# EAGLE schematic delay_v03 (EAGLE 6.2)
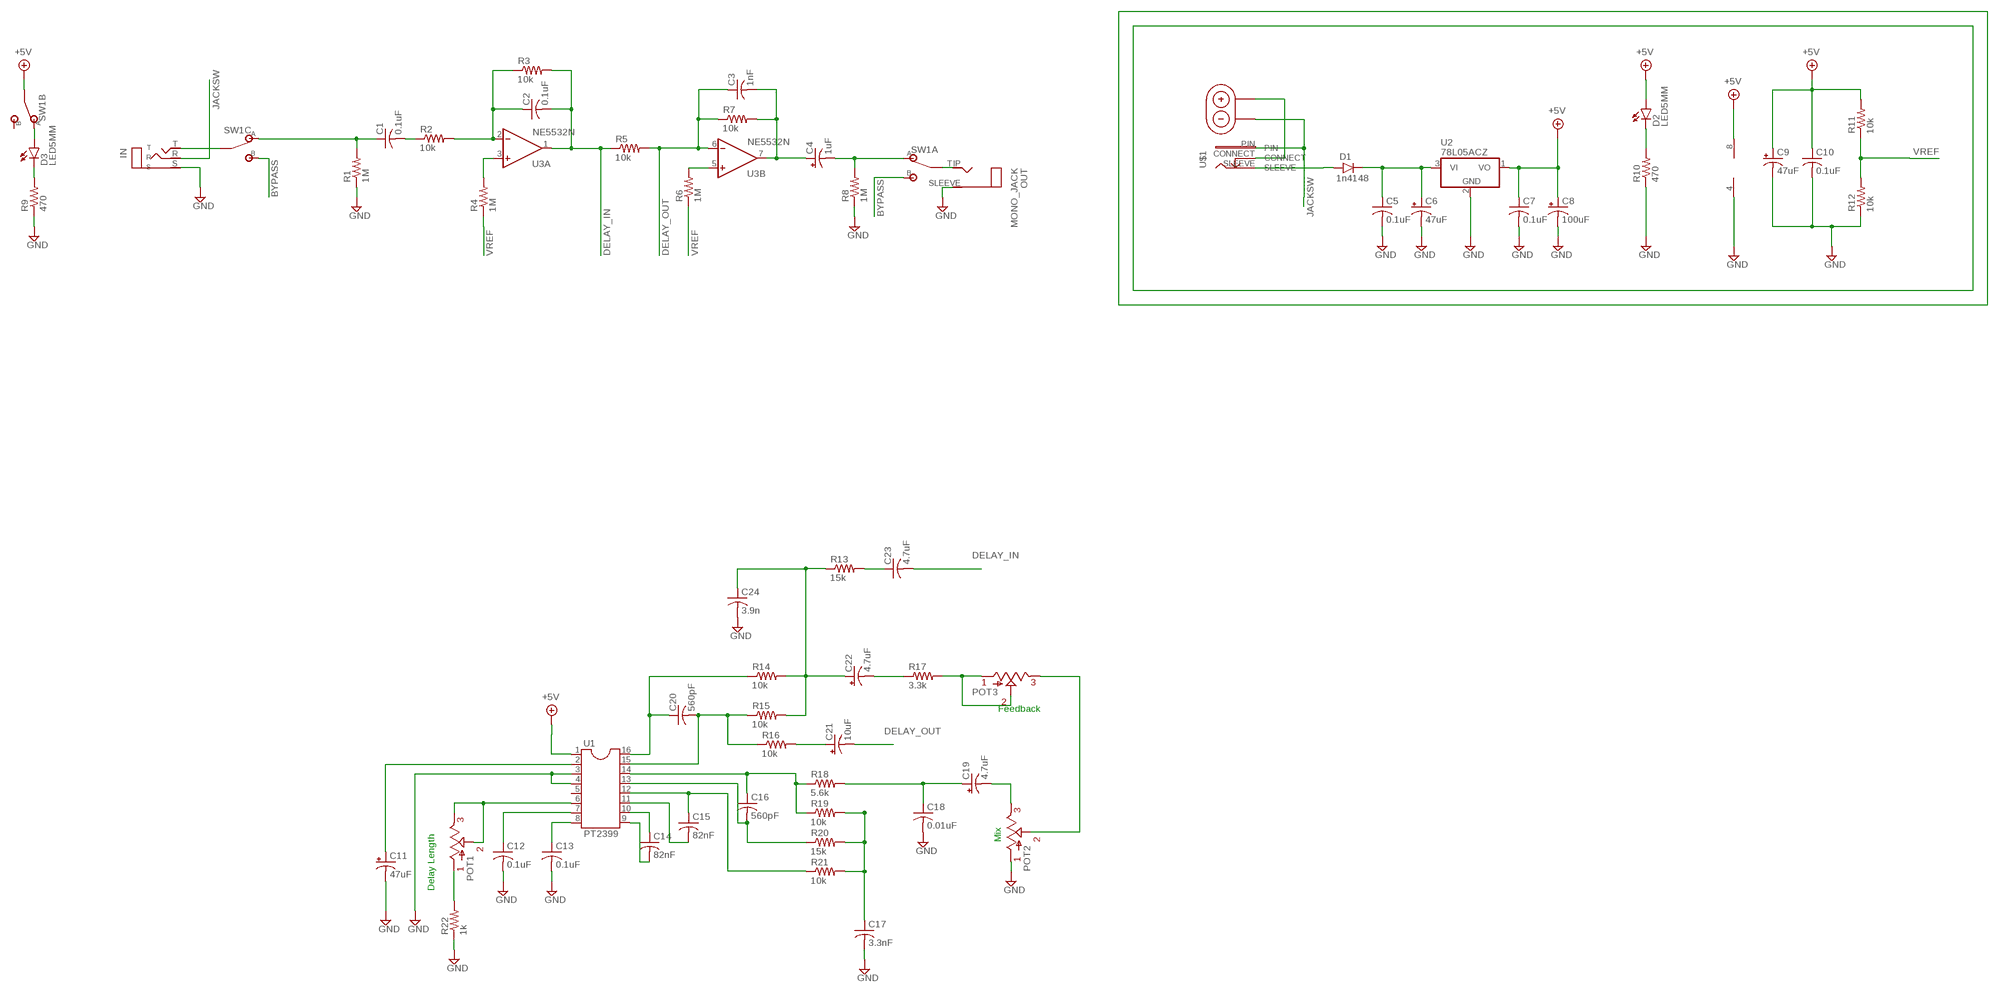
[diagram p0: schematic, sheet 1]

## Parts
C1  0.1uF  C-US050-035X075  [C050-035X075]
C2  0.1uF  C-US050-035X075  [C050-035X075]
C3  1nF  C-US050-035X075  [C050-035X075]
C4  1uF  0631  [063_025]
C5  0.1uF  C-US050-035X075  [C050-035X075]
C6  47uF  0631  [063_025]
C7  0.1uF  C-US050-035X075  [C050-035X075]
C8  100uF  0631  [063_025]
C9  47uF  0631  [063_025]
C10  0.1uF  C-US050-035X075  [C050-035X075]
C11  47uF  0631  [063_025]
C12  0.1uF  C-US050-035X075  [C050-035X075]
C13  0.1uF  C-US050-035X075  [C050-035X075]
C14  82nF  C-US050-035X075  [C050-035X075]
C15  82nF  C-US050-035X075  [C050-035X075]
C16  560pF  C-US050-035X075  [C050-035X075]
C17  3.3nF  C-US050-035X075  [C050-035X075]
C18  0.01uF  C-US050-035X075  [C050-035X075]
C19  4.7uF  0631  [063_025]
C20  560pF  C-US050-035X075  [C050-035X075]
C21  10uF  0631  [063_025]
C22  4.7uF  0631  [063_025]
C23  4.7uF  C-US050-035X075  [C050-035X075]
C24  3.9n  C-US050-035X075  [C050-035X075]
D1  1n4148  1N400X.3  [DO41-3]
D2  LED5MM  [LED5MM]
D3  LED5MM  [LED5MM]
IN  STEREO_JACK  [STEREO_JACK]
OUT  MONO_JACK  [MONO_JACK]
POT1  POT  [POT]
POT2  POT  [POT]
POT3  POT  [POT]
R1  1M  RESISTOR  [RESISTOR]
R2  10k  RESISTOR  [RESISTOR]
R3  10k  RESISTOR  [RESISTOR]
R4  1M  RESISTOR  [RESISTOR]
R5  10k  RESISTOR  [RESISTOR]
R6  1M  RESISTOR  [RESISTOR]
R7  10k  RESISTOR  [RESISTOR]
R8  1M  RESISTOR  [RESISTOR]
R9  470  RESISTOR  [RESISTOR]
R10  470  RESISTOR  [RESISTOR]
R11  10k  RESISTOR  [RESISTOR]
R12  10k  RESISTOR  [RESISTOR]
R13  15k  RESISTOR  [RESISTOR]
R14  10k  RESISTOR  [RESISTOR]
R15  10k  RESISTOR  [RESISTOR]
R16  10k  RESISTOR  [RESISTOR]
R17  3.3k  RESISTOR  [RESISTOR]
R18  5.6k  RESISTOR  [RESISTOR]
R19  10k  RESISTOR  [RESISTOR]
R20  15k  RESISTOR  [RESISTOR]
R21  10k  RESISTOR  [RESISTOR]
R22  1k  RESISTOR  [RESISTOR]
SW1  3PDT  [3PDT]
U1  PT2399  DIL16S  [SOCKET-16]
U2  78L05ACZ  [TO-92]
U3  NE5532N  [DIL08]
U$1  DC_JACK_OFFBOARD  [DC_JACK_OFFBOARD]
U$2  9V_BATTERY_CLIP  [9V_BATTERY]

## Nets
9V: C5.1 C6.+ D1.C U2.3(VI)
BYPASS: SW1.A3(A:B) SW1.C3(C:B)
C5*: C13.1 U1.8
DELAY_IN: C2.2 C23.2 R3.2 R5.1 U3.1(A:OUT)
DELAY_OUT: C3.1 C21.- R5.2 R7.1 U3.6(B:-IN)
DELAY_OUT_UNBUFFERED: R6.2 U3.5(B:+IN)
GND: C5.2 C6.- C7.2 C8.- C9.- C10.2 C11.- C12.2 C13.2 C17.2 C18.2 C24.2 IN.S OUT.SLEEVE POT2.1 R1.1 R8.1 R9.1 R10.1 R12.1 R22.1 U1.3 U1.4 U2.2(GND) U3.4(P:V-)
JACKSW: IN.R U$1.PIN U$2.9V_BATTERY_-
N$1: C23.1 R13.2
N$2: C12.1 U1.7
N$3: C14.2 U1.9
N$4: C14.1 U1.10
N$5: C17.1 R19.2 R20.2 R21.2
N$6: C15.1 R21.1 U1.12
N$7: POT1.2 POT1.3 U1.6
N$9: C11.+ U1.2
N$10: C1.1 R1.2 SW1.C1(C:A)
N$11: POT1.1 R22.2
N$12: C16.2 R20.1 U1.13
N$13: OUT.TIP SW1.A2(A:COM)
N$14: C20.2 R15.1 R16.1 U1.15
N$15: C20.1 R14.1 U1.16
N$16: C18.1 C19.+ R18.2
N$17: C15.2 U1.11
N$18: C2.1 R2.2 R3.1 U3.2(A:-IN)
N$19: C19.- POT2.3
N$20: C22.+ C24.1 R13.1 R14.2 R15.2
N$21: C22.- R17.1
N$22: C1.2 R2.1
N$24: POT2.2 POT3.3
N$25: C21.+ R16.2
N$26: C16.1 R18.1 R19.1 U1.14
N$27: D3.A SW1.B1(B:A)
N$28: C3.2 C4.+ R7.2 U3.7(B:OUT)
N$29: D2.K(C) R10.2
N$30: D1.A U$1.SLEEVE
N$31: IN.T SW1.C2(C:COM)
N$32: C4.- R8.2 SW1.A1(A:A)
N$33: U$1.CONNECT U$2.9V_BATTERY_+
N$34: D3.K(C) R9.2
N$35: POT3.1 POT3.2 R17.2
N$36: R4.2 U3.3(A:+IN)
VA: C7.1 C8.+ C9.+ C10.1 D2.A R11.2 SW1.B2(B:COM) U1.1 U2.1(VO) U3.8(P:V+) ; supply symbol labelled +5V
VREF: R4.1 R6.1 R11.1 R12.2
Unconnected: SW1.B3(B:B) U1.5

## Notes on the sheet
- Feedback
- Mix
- Delay Length

## Library data of the parts
C1-C3 C5 C7 C10 C12-C18 C20 C23 C24 = resistor:C-US: CAPACITOR, American symbol
C4 C6 C8 C9 C11 C19 C21 C22 = gm-caps-electro-pol:063: 33 - 220uF Xicon values at Mouser.com 10V: 220uF; 16V: 100uF; 25V: 100uF; 50V: 33uF
D1 = gm-diodes:1N400X: Rectifier Diodes often used in power supply to prevent damage from reverse polarization
D2 D3 = gm-diodes:LED
IN = 00_steve:STEREO_JACK
OUT = 00_steve:MONO_JACK
POT1-POT3 = 00_steve:POT
R1-R22 = 00_steve:RESISTOR
SW1 = 00_steve:3PDT
U1 = ic-package:DIL16: Dual In Line / Socket
U2 = 00_steve:78L05ACZ
U3 = gm-ics:NE5532: AUDIO AMPLIFIER
U$1 = 00_steve:DC_JACK_OFFBOARD
U$2 = 00_steve:9V_BATTERY_CLIP